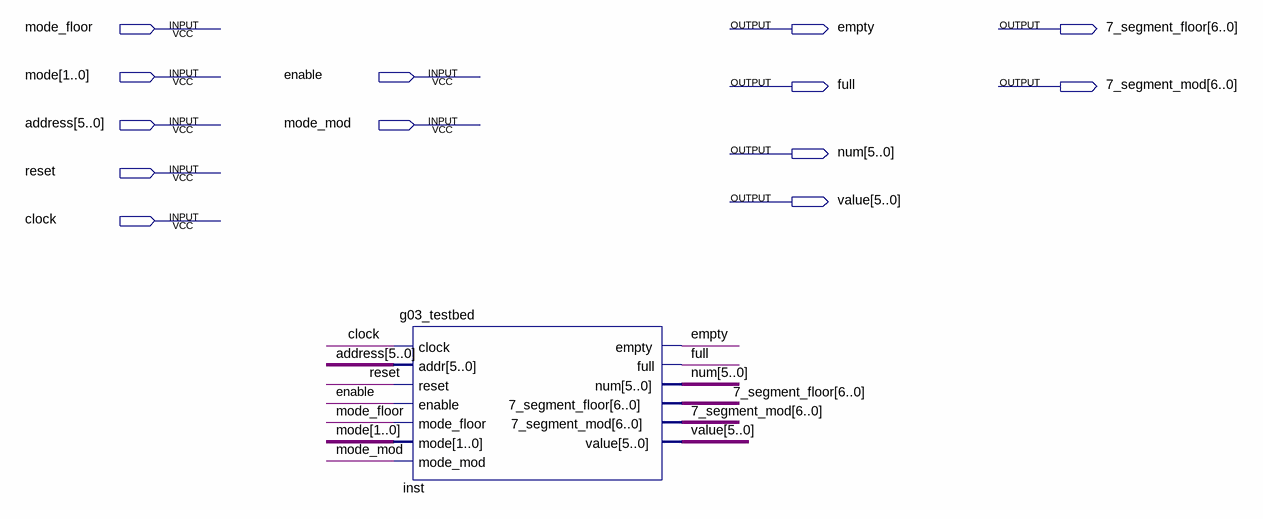
[diagram p0: schematic sheet]
// Quartus schematic g03_lab3.bdf as structural Verilog: 1 symbols, 13 pins
module g03_lab3 (
  input  mode_floor,
  input  [1:0] mode,
  input  enable,
  input  [5:0] address,
  input  mode_mod,
  input  reset,
  input  clock,
  output empty,
  output [6:0] \7_segment_floor ,
  output full,
  output [6:0] \7_segment_mod ,
  output [5:0] num,
  output [5:0] value
);

  g03_testbed inst (
    .clock(clock), .addr(address), .reset(reset), .enable(enable), .mode_floor(mode_floor), .mode(mode),
    .mode_mod(mode_mod), .empty(empty), .full(full), .num(num), .\7_segment_floor (\7_segment_floor ),
    .\7_segment_mod (\7_segment_mod ), .value(value));
endmodule
